# Altium schematic sheet 主控单元.schdoc
size 418 x 270 mm
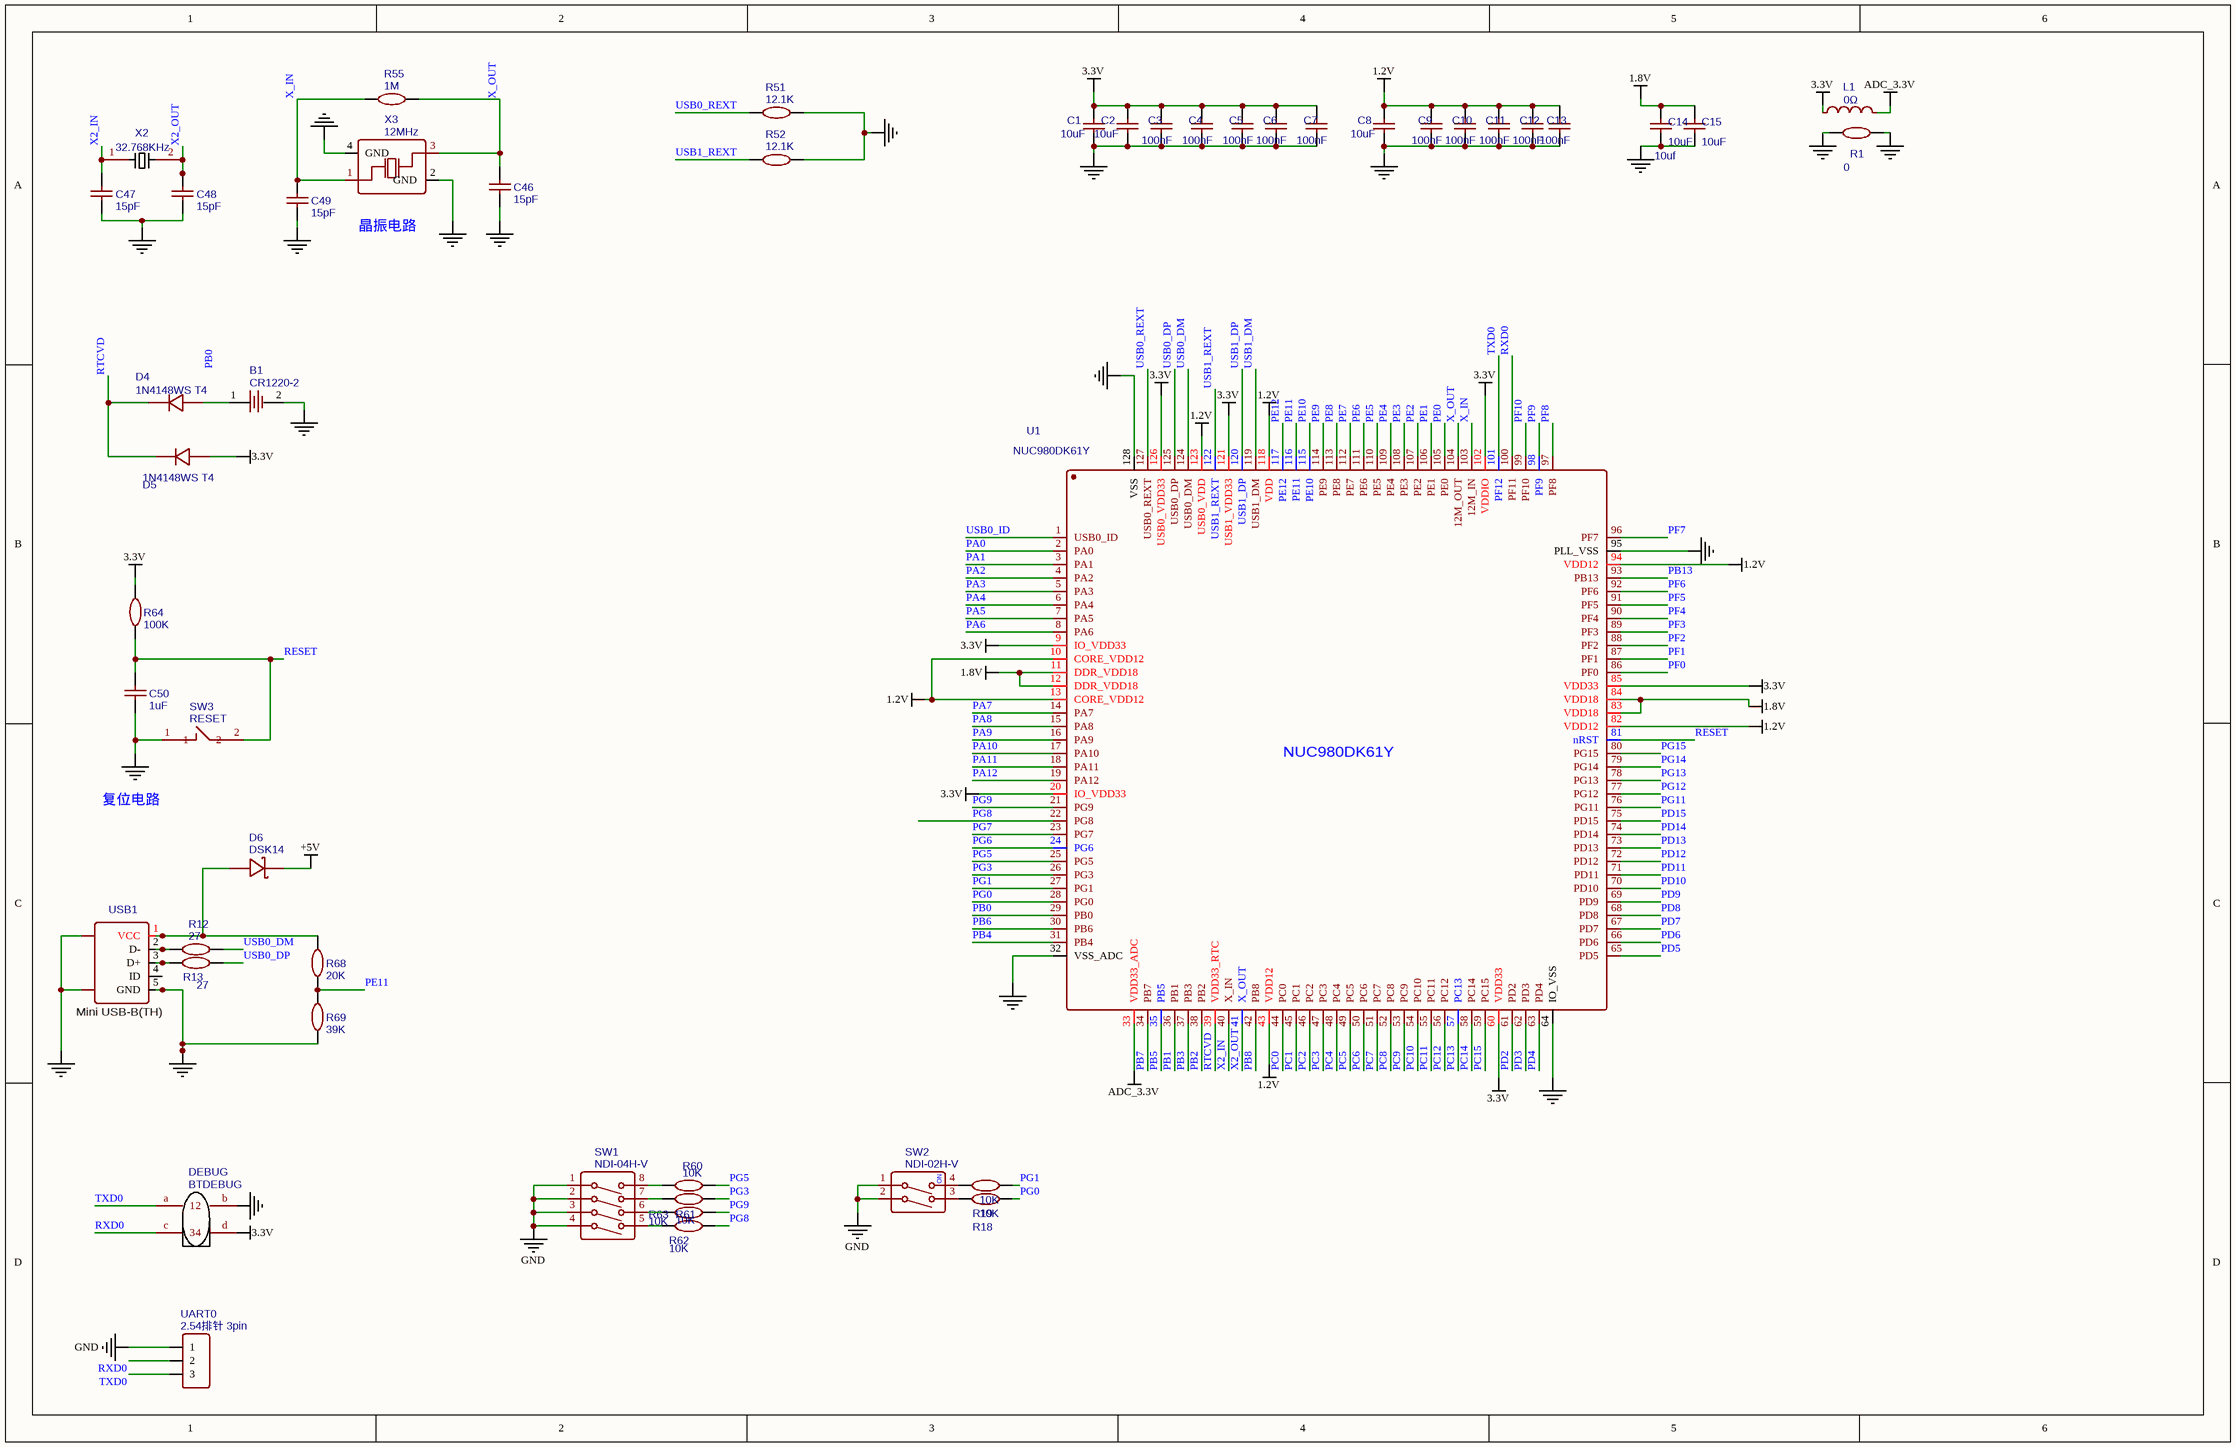
[diagram p0: 主控单元.schdoc]

## Parts
B1  CR1220-2  [BATTERY-2]
C1  10uF  [0805]
C2  10uF  [0805]
C3  100nF  [0402]
C4  100nF  [0402]
C5  100nF  [0402]
C6  100nF  [0402]
C7  100nF  [0402]
C8  10uF  [0805]
C9  100nF  [0402]
C10  100nF  [0402]
C11  100nF  [0402]
C12  100nF  [0402]
C13  100nF  [0402]
C14  10uF  [0805]
C15  10uF  [0805]
C46  15pF  [0402]
C47  15pF  [0402]
C48  15pF  [0402]
C49  15pF  [0402]
C50  1uF  [0603]
D4  1N4148WS T4  [SOD-323]
D5  1N4148WS T4  [SOD-323]
D6  DSK14  [SOD-123]
DEBUG  BTDEBUG  [4PINO]
L1  0Ω  [0603]
R1  0  [0603]
R12  27  [0603]
R13  27  [0603]
R18  10K  [0603]
R19  10K  [0603]
R51  12.1K  [0603]
R52  12.1K  [0603]
R55  1M  [0402]
R60  10K  [0603]
R61  10K  [0603]
R62  10K  [0603]
R63  10K  [0603]
R64  100K  [0603]
R68  20K  [0402]
R69  39K  [0402]
SW1  NDI-04H-V  [NDI-04H-V]
SW2  NDI-02H-V  [NDI-02H-V]
SW3  RESET  [KEY-TOUCH-SMD-6.0*3.5*H-(A)]
U1  NUC980DK61Y  [LQFP-128_14X14X04P]
UART0  2.54排针 3pin  [HDR-3X1/2.54]
USB1  Mini USB-B 5P-Female-TH_C46398  [USB-MINI-2]  (value not drawn)
X2  32.768KHz  [SMD-3215_2P]
X3  12MHz  [OSC-YSX-3225_4P]

## Nets
1.2V: C8.2 C9.2 C10.2 C11.2 C12.2 C13.2 U1.10(CORE_VDD12) U1.13(CORE_VDD12) U1.43(VDD12) U1.82(VDD12) U1.94(VDD12) U1.118(VDD) U1.123(USB0_VDD)
1.8V: C14.2 C15.2 U1.11(DDR_VDD18) U1.12(DDR_VDD18) U1.83(VDD18) U1.84(VDD18)
3.3V: C1.2 C2.2 C3.2 C4.2 C5.2 C6.2 C7.2 D5.1(A) DEBUG.d(4) L1.1 R64.2 U1.9(IO_VDD33) U1.20(IO_VDD33) U1.60(VDD33) U1.85(VDD33) U1.102(VDDIO) U1.121(USB1_VDD33) U1.126(USB0_VDD33)
+5V: D6.2(K)
ADC_3.3V: L1.2 U1.33(VDD33_ADC)
GND: B1.2 C1.1 C2.1 C3.1 C4.1 C5.1 C6.1 C7.1 C8.1 C9.1 C10.1 C11.1 C12.1 C13.1 C14.1 C15.1 C46.1 C47.1 C48.1 C49.1 C50.1 DEBUG.b(2) R1.1 R51.1 R52.1 R69.1 SW1.1 SW1.2 SW1.3 SW1.4 SW2.1 SW2.2 SW3.1 U1.64(IO_VSS) U1.95(PLL_VSS) U1.128(VSS) UART0.1 USB1.0 USB1.5(GND) X3.2(GND) X3.4(GND)
GND1: R1.2 U1.32(VSS_ADC)
PA0: U1.2(PA0)
PA1: U1.3(PA1)
PA2: U1.4(PA2)
PA3: U1.5(PA3)
PA4: U1.6(PA4)
PA5: U1.7(PA5)
PA6: U1.8(PA6)
PA7: U1.14(PA7)
PA8: U1.15(PA8)
PA9: U1.16(PA9)
PA10: U1.17(PA10)
PA11: U1.18(PA11)
PA12: U1.19(PA12)
PB0: U1.29(PB0)
PB1: U1.36(PB1)
PB2: U1.38(PB2)
PB3: U1.37(PB3)
PB4: U1.31(PB4)
PB5: U1.35(PB5)
PB6: U1.30(PB6)
PB7: U1.34(PB7)
PB8: U1.42(PB8)
PB13: U1.93(PB13)
PC0: U1.44(PC0)
PC1: U1.45(PC1)
PC2: U1.46(PC2)
PC3: U1.47(PC3)
PC4: U1.48(PC4)
PC5: U1.49(PC5)
PC6: U1.50(PC6)
PC7: U1.51(PC7)
PC8: U1.52(PC8)
PC9: U1.53(PC9)
PC10: U1.54(PC10)
PC11: U1.55(PC11)
PC12: U1.56(PC12)
PC13: U1.57(PC13)
PC14: U1.58(PC14)
PC15: U1.59(PC15)
PD2: U1.61(PD2)
PD3: U1.62(PD3)
PD4: U1.63(PD4)
PD5: U1.65(PD5)
PD6: U1.66(PD6)
PD7: U1.67(PD7)
PD8: U1.68(PD8)
PD9: U1.69(PD9)
PD10: U1.70(PD10)
PD11: U1.71(PD11)
PD12: U1.72(PD12)
PD13: U1.73(PD13)
PD14: U1.74(PD14)
PD15: U1.75(PD15)
PE0: U1.105(PE0)
PE1: U1.106(PE1)
PE2: U1.107(PE2)
PE3: U1.108(PE3)
PE4: U1.109(PE4)
PE5: U1.110(PE5)
PE6: U1.111(PE6)
PE7: U1.112(PE7)
PE8: U1.113(PE8)
PE9: U1.114(PE9)
PE10: U1.115(PE10)
PE11: R68.1 R69.2 U1.116(PE11)
PE12: U1.117(PE12)
PF0: U1.86(PF0)
PF1: U1.87(PF1)
PF2: U1.88(PF2)
PF3: U1.89(PF3)
PF4: U1.90(PF4)
PF5: U1.91(PF5)
PF6: U1.92(PF6)
PF7: U1.96(PF7)
PF8: U1.97(PF8)
PF9: U1.98(PF9)
PF10: U1.99(PF10)
PG0: R18.1 U1.28(PG0)
PG1: R19.1 U1.27(PG1)
PG3: R61.1 U1.26(PG3)
PG5: R60.1 U1.25(PG5)
PG6: U1.24(PG6)
PG7: U1.23(PG7)
PG8: R62.1 U1.22(PG8)
PG9: R63.1 U1.21(PG9)
PG11: U1.76(PG11)
PG12: U1.77(PG12)
PG13: U1.78(PG13)
PG14: U1.79(PG14)
PG15: U1.80(PG15)
RESET: C50.2 R64.1 SW3.2 U1.81(nRST)
RTCVD: D4.2(K) D5.2(K) U1.39(VDD33_RTC)
RXD0: DEBUG.c(3) U1.100(PF11) UART0.2
TXD0: DEBUG.a(1) U1.101(PF12) UART0.3
USB0_DM: R12.2 U1.124(USB0_DM)
USB0_DP: R13.2 U1.125(USB0_DP)
USB0_ID: U1.1(USB0_ID)
USB0_REXT: R51.2 U1.127(USB0_REXT)
USB1_DM: U1.119(USB1_DM)
USB1_DP: U1.120(USB1_DP)
USB1_REXT: R52.2 U1.122(USB1_REXT)
X2_IN: C47.2 U1.40(X_IN) X2.1
X2_OUT: C48.2 U1.41(X_OUT) X2.2
X_IN: C49.2 R55.1 U1.103(12M_IN) X3.1(OSC1)
X_OUT: C46.2 R55.2 U1.104(12M_OUT) X3.3(OSC2)
NetB1_1: B1.1 D4.1(A)
NetD6_1: D6.1(A) R68.2 USB1.1(VCC)
NetR12_1: R12.1 USB1.2(D-)
NetR13_1: R13.1 USB1.3(D+)
NetR18_2: R18.2 SW2.3
NetR19_2: R19.2 SW2.4
NetR60_2: R60.2 SW1.8
NetR61_2: R61.2 SW1.7
NetR62_2: R62.2 SW1.5
NetR63_2: R63.2 SW1.6

Not connected (* = marked no-connect by the designer): USB1 4(ID)

## Notes on the sheet
- 10uf
- 晶振电路
- 复位电路
- Labels drawn without touching a wire or pin: PB0
- (in symbol Mini USB-B 5P-Female-TH_C46398) Mini USB-B(TH)
- (in symbol NDI-02H-V) ON

## Library data of the parts
B1 = CR1220-2: BOM_Manufacturer: Q&J; BOM_Supplier: LCSC; BOM_Manufacturer Part: CR1220-2; image: //image.lceda.cn/szlcsc/C70381.jpg; BOM_Supplier Part: C70381; spicePre: B
C1 C2 C8 C14 C15 = 10uF: BOM_Manufacturer Part: CL21A106KAYNNNE; BOM_Manufacturer: SAMSUNG; nameAlias: Capacitance; BOM_Supplier: LCSC; BOM_LCSC Assembly: Yes; BOM_Supplier Part: C15850; spicePre: C; spiceSymbolName: CL21A106KAYNNNE
C3-C7 C9-C13 = 100nF: BOM_Manufacturer Part: CL05B104KO5NNNC; BOM_Manufacturer: SAMSUNG; nameAlias: Capacitance; BOM_Supplier: LCSC; BOM_LCSC Assembly: Yes; BOM_Supplier Part: C1525; spicePre: C; spiceSymbolName: CL05B104KO5NNNC
C46-C49 = 15pF: BOM_Manufacturer: FH; BOM_Manufacturer Part: 0402CG150J500NT; nameAlias: Capacitance; BOM_Supplier: LCSC; BOM_LCSC Assembly: Yes; BOM_Supplier Part: C1548; spicePre: C; spiceSymbolName: 0402CG150J500NT
C50 = 1uF: BOM_Manufacturer Part: CL10A105KB8NNNC; BOM_Manufacturer: SAMSUNG; nameAlias: Capacitance; SMT Type: Basic; BOM_Supplier: LCSC; BOM_LCSC Assembly: Yes; BOM_Supplier Part: C15849; spicePre: C; spiceSymbolName: CL10A105KB8NNNC
D4 D5 = 1N4148WS T4: BOM_Manufacturer: CJ; BOM_Supplier: LCSC; BOM_Manufacturer Part: 1N4148WS T4; BOM_LCSC Assembly: Yes; image: //image.lceda.cn/szlcsc/C2128.jpg; BOM_Supplier Part: C2128; spicePre: D
D6 = DSK14: BOM_Manufacturer: MDD; SMT Type: Extend; BOM_Supplier: LCSC; BOM_Manufacturer Part: DSK14; image: //image.lceda.cn/szlcsc/C37049.jpg; BOM_Supplier Part: C37049; BOM_LCSC Assembly: Yes; spicePre: D
DEBUG = BTDEBUG: Contributor: wode320; sourceId: oYS93lDVP; timeStamp: 1450252921; BOM_Manufacturer Part: ?; spicePre: U
L1 = 0Ω: BOM_Manufacturer: FH; BOM_Manufacturer Part: CBG160808U000T; nameAlias: Value; SMT Type: Extend; BOM_Supplier: LCSC; BOM_Supplier Part: C43163; BOM_LCSC Assembly: Yes; spicePre: L; spiceSymbolName: CBG160808U000T
R1 = 0: BOM_Manufacturer: UniOhm; BOM_Manufacturer Part: 0603WAF0000T5E; nameAlias: Resistance (Ohms); SMT Type: Basic; BOM_Supplier: LCSC; BOM_LCSC Assembly: Yes; BOM_Supplier Part: C21189; spicePre: R; spiceSymbolName: 0603WAF0000T5E
R12 R13 = 27: BOM_Manufacturer: UniOhm; BOM_Manufacturer Part: 0603WAF270JT5E; nameAlias: Resistance (Ohms); SMT Type: Basic; BOM_Supplier: LCSC; BOM_LCSC Assembly: Yes; BOM_Supplier Part: C25190; spicePre: R; spiceSymbolName: 0603WAF270JT5E
R18 R19 R60-R63 = 10K: BOM_Manufacturer: UniOhm; BOM_Manufacturer Part: 0603WAF1002T5E; nameAlias: Resistance (Ohms); BOM_Supplier: LCSC; BOM_LCSC Assembly: Yes; BOM_Supplier Part: C25804; spicePre: R; spiceSymbolName: 0603WAF1002T5E
R51 R52 = 12.1K: BOM_Manufacturer: UniOhm; BOM_Manufacturer Part: 0603WAF1212T5E; nameAlias: Resistance (Ohms); SMT Type: Extend; BOM_Supplier: LCSC; BOM_Supplier Part: C22864; BOM_LCSC Assembly: Yes; spicePre: R; spiceSymbolName: 0603WAF1212T5E
R55 = 1M: BOM_Manufacturer: UniOhm; BOM_Manufacturer Part: 0402WGF1004TCE; nameAlias: Resistance (Ohms); BOM_Supplier: LCSC; BOM_LCSC Assembly: Yes; BOM_Supplier Part: C26083; spicePre: R; spiceSymbolName: 0402WGF1004TCE
R64 = 100K: BOM_Manufacturer: UniOhm; BOM_Manufacturer Part: 0603WAF1003T5E; nameAlias: Resistance (Ohms); SMT Type: Basic; BOM_Supplier: LCSC; BOM_LCSC Assembly: Yes; BOM_Supplier Part: C25803; spicePre: R; spiceSymbolName: 0603WAF1003T5E
R68 = 20K: BOM_Manufacturer: UniOhm; BOM_Manufacturer Part: 0402WGF2002TCE; nameAlias: Resistance (Ohms); BOM_Supplier: LCSC; BOM_LCSC Assembly: Yes; BOM_Supplier Part: C25765; spicePre: R; spiceSymbolName: 0402WGF2002TCE
R69 = 39K: BOM_Manufacturer: UniOhm; BOM_Manufacturer Part: 0402WGF3902TCE; nameAlias: Resistance (Ohms); BOM_Supplier: LCSC; BOM_LCSC Assembly: Yes; BOM_Supplier Part: C25783; spicePre: R; spiceSymbolName: 0402WGF3902TCE
SW1 = NDI-04H-V: BOM_Manufacturer: Diptronics; Contributor: LCSC; BOM_Supplier: LCSC; BOM_Supplier Part: C225000; BOM_Manufacturer Part: NDI-04H-V; spicePre: S
SW2 = NDI-02H-V: BOM_Manufacturer: Diptronics; Contributor: LCSC; BOM_Supplier: LCSC; BOM_Supplier Part: C224999; BOM_Manufacturer Part: NDI-02H-V; spicePre: S
SW3 = RESET: BOM_Manufacturer: HYP; BOM_Manufacturer Part: 1TS002B-1900-4300; Contributor: LCSC; BOM_Supplier: LCSC; BOM_Supplier Part: C318823; spicePre: S
U1 = NUC980DK61Y: Contributor: 13603072355; BOM_Manufacturer Part: ?; spicePre: U
UART0 = 2.54排针 3pin: BOM_Manufacturer: BOOMELE; BOM_Manufacturer Part: Header2.54mm 1*3P; Contributor: yds432427; BOM_Supplier: LCSC; image: //image.lceda.cn/szlcsc/C49257.jpg; BOM_Supplier Part: C49257; spicePre: P
USB1 = Mini USB-B 5P-Female-TH_C46398: BOM_Manufacturer: ValuePro; BOM_Manufacturer Part: MINI 5PFemale90Degree plate four feet copper shell LCPVinyl; BOM_Supplier: LCSC; image: //image.lceda.cn/szlcsc/C46398.jpg; BOM_Supplier Part: C46398; spicePre: U
X2 = 32.768KHz: BOM_Manufacturer Part: Q13FC1350000400; BOM_Manufacturer: EPSON; nameAlias: Frequency; BOM_Supplier: LCSC; BOM_LCSC Assembly: Yes; BOM_Supplier Part: C32346; spicePre: X; spiceSymbolName: Q13FC1350000400
X3 = 12MHz: BOM_Manufacturer: YXC; BOM_Manufacturer Part: X322512MSB4SI; nameAlias: Frequency; BOM_Supplier: LCSC; BOM_LCSC Assembly: Yes; BOM_Supplier Part: C9002; spicePre: X; spiceSymbolName: X322512MSB4SI